# EAGLE design BUZZI-03 (EAGLE 4.15)
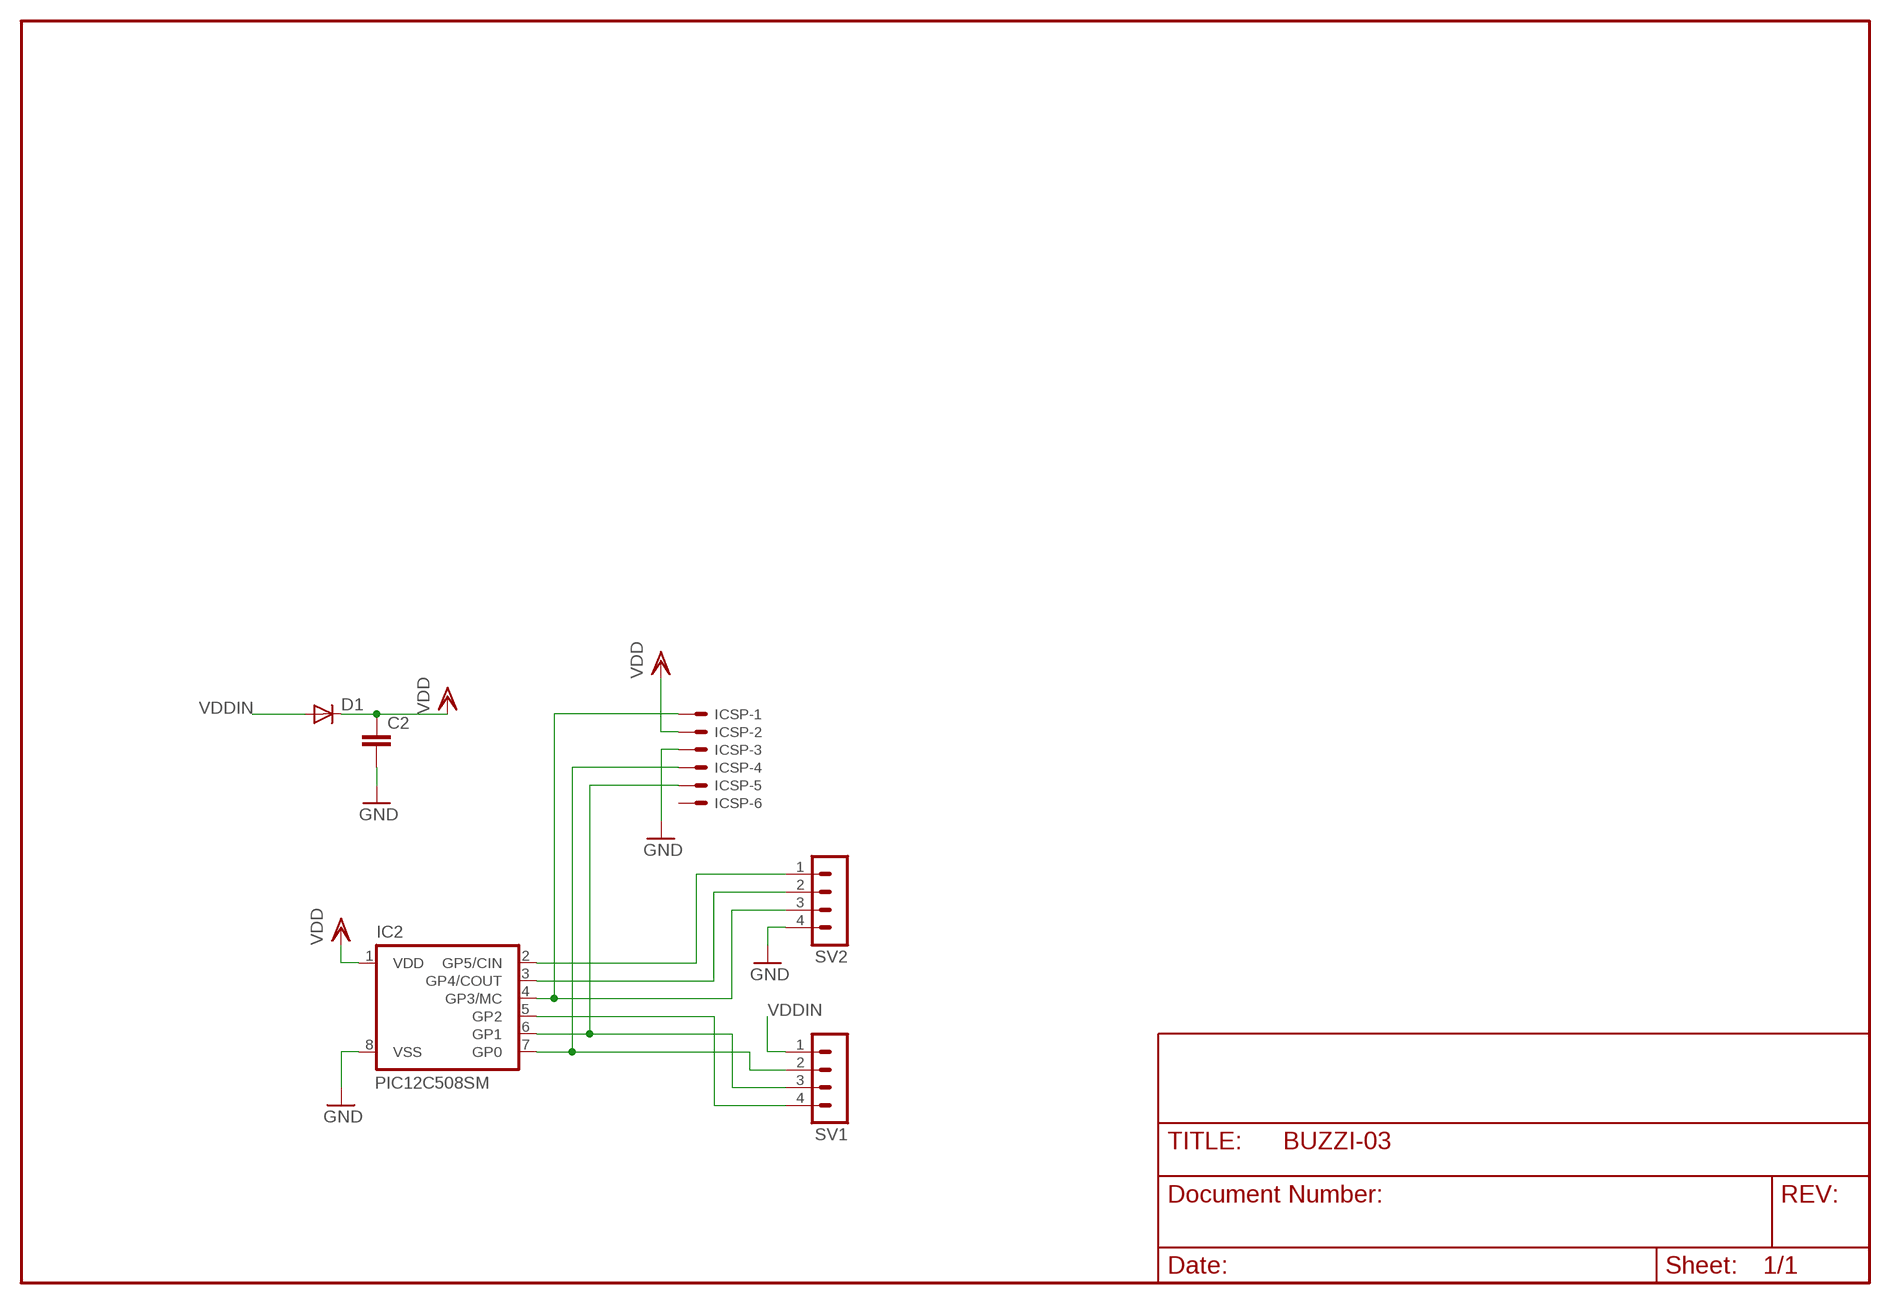
[diagram p0: schematic, sheet 1]

## Parts
C2  C-EUC0805  [C0805]
D1  DIODE-SOD80C  [SOD80C]
IC2  PIC12C508SM  [SO-08M]
ICSP  53047-06  [53047-06]
SV1  MA04-1  [MA04-1]
SV2  MA04-1  [MA04-1]

## Nets
GND: C2.2 IC2.8(VSS) ICSP.3 SV2.4
N$1: IC2.5(GP2) SV1.4
N$2: IC2.6(GP1) ICSP.5 SV1.3
N$3: IC2.7(GP0) ICSP.4 SV1.2
N$4: IC2.4(GP3/MC) ICSP.1 SV2.3
N$5: IC2.2(GP5/CIN) SV2.1
N$7: IC2.3(GP4/COUT) SV2.2
VDD: C2.1 D1.C IC2.1(VDD) ICSP.2
VDDIN: D1.A SV1.1
Unconnected: ICSP.6

## Library data of the parts
C2 = rcl:C-EU: CAPACITOR, European symbol
D1 = diode:DIODE-: DIODE
IC2 = microchip:PIC12C*?: MICROCONTROLLER
ICSP = con-molex:53?-06: CONNECTOR wire to board 1.25 mm (.049 inch) pitch header
SV1 SV2 = con-lstb:MA04-1: PIN HEADER

## Board
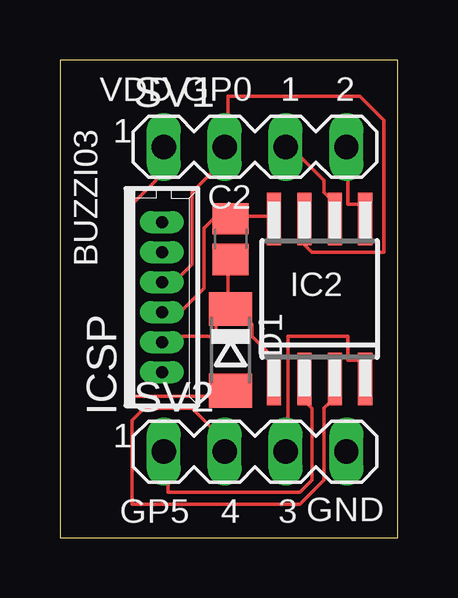
[diagram p1: board, top side]
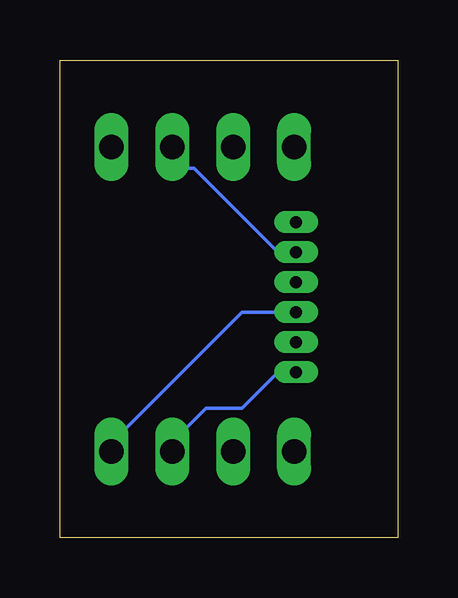
[diagram p2: board, bottom side, seen from below]

Size 14.1 x 19.9 mm. Coordinates in mm from the lower left corner, seen from the top.
Outline: 0,0 14.1,0 14.1,19.9 0,19.9 0,0
Copper layers (1*16): Top 0.035mm / dielectric 1.5mm / Bottom 0.035mm
Design rules "PCB-POOL": minimum track width 6mil, minimum drill 12mil, track to track 6mil, track to pad 6mil, pad to pad 6mil, via to via 6mil, smd to smd 6mil, copper to edge 20mil, drill to drill 8mil, minimum pad ring 8mil, minimum via ring 6mil, stop-mask expansion 3mil, vias tented up to drill 0mil, thermal gap 8mil

### Footprints (pad centres in the part's own frame; a part is rotated, then mirrored left to right if it is on the bottom)
C0805 = smd 1.3 x 1.5: 1 -0.85,0; 2 0.85,0
SOD80C = smd 1.4 x 1.8: A 1.7,0; C -1.7,0
SO-08M = smd 0.6 x 2.2: 1 -1.905,-3.33; 2 -0.635,-3.33; 3 0.635,-3.33; 4 1.905,-3.33; 5 1.905,3.33; 6 0.635,3.33; 7 -0.635,3.33; 8 -1.905,3.33
53047-06 = drill 0.5 pad 0.698 long: 1 3.125,0; 2 1.875,0; 3 0.625,0; 4 -0.625,0; 5 -1.875,0; 6 -3.125,0
MA04-1 = drill 1.016 long: 1 -3.81,0; 2 -1.27,0; 3 1.27,0; 4 3.81,0

### Placement (x,y rotation side)
C2  7.12,12.44 90 top
D1  7.12,7.82 270 top
IC2  10.83,9.94 0 top
ICSP  4.25,10.02 270 top
SV1  8.14,16.28 0 top
SV2  8.14,3.58 0 top

### Tracks (layer width: path | path; a pad name or v marks a point on that pad's centre or on a via)
GND
  Top 0.152: IC2.8 9,13.4 7.5,13.4 C2.2 6.5,13.4 6,12.9 6,10.4 5,9.4 ICSP.3
  Bottom 0.152: SV2.4 11.5,4.4 6.5,9.4 5,9.4 ICSP.3
N$1
  Top 0.152: IC2.5 12.5,13.9 12,13.9 12,14.9 SV1.4
N$2
  Top 0.152: IC2.6 11.5,13.9 11,14.4 11,14.9 10,15.9 SV1.3
  Bottom 0.152: ICSP.5 5,11.9 8.5,15.4 9,15.4 SV1.3
N$3
  Top 0.152: ICSP.4 5,10.9 5.5,11.4 5.5,14.4 6.5,15.4 SV1.2 7,17.4 7,18.4 12.5,18.4 13.5,17.4 13.5,11.9 10.5,11.9 10,12.4 IC2.7
N$4
  Top 0.152: IC2.4 12.5,7.4 12,7.4 12,8.4 9.5,8.4 9.5,4.9 SV2.3
  Bottom 0.152: ICSP.1 5,6.9 6.5,5.4 8,5.4 9,4.4 SV2.3
N$5
  Top 0.152: IC2.2 10,5.9 10.5,5.4 10.5,2.4 10,1.9 4.5,1.9 4.5,2.4 SV2.1
N$7
  Top 0.152: IC2.3 11.5,5.9 11,5.4 11,2.4 10,1.4 3,1.4 3,4.9 3.5,5.4 5.5,5.4 6.5,4.4 SV2.2
VDD
  Top 0.152: C2.1 7,11.4 7,9.9 D1.C | ICSP.2 5,8.4 6.5,8.4 6.5,8.9 D1.C | IC2.1 9,7.4 8,8.4 8,8.9 D1.C
VDDIN
  Top 0.152: D1.A 6.5,5.9 3,5.9 3,13.9 4,14.9 SV1.1

### Text on the board
tPlace: VDD | GP0 | 1 | 2 | BUZZI03 | GP5 | 4 | 3 | GND